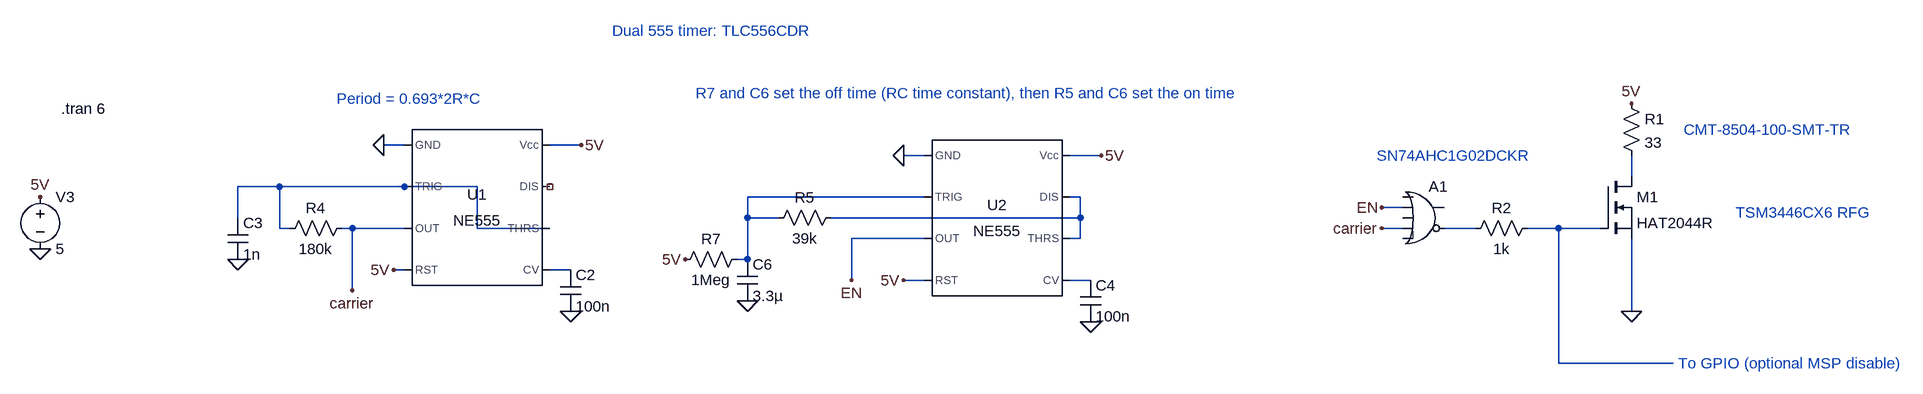
[diagram p0: schematic buzzer circuit.asc]
buzzer circuit.asc, the LTspice schematic file:
Version 4
SHEET 1 3336 748
WIRE 1008 368 976 368
WIRE 1280 368 1232 368
WIRE 1808 384 1776 384
WIRE 2080 384 2032 384
WIRE 2896 416 2896 384
WIRE 816 432 752 432
WIRE 1008 432 816 432
WIRE 1120 432 1008 432
WIRE 1808 448 1536 448
WIRE 2048 448 2032 448
WIRE 2544 464 2512 464
WIRE 752 480 752 432
WIRE 1536 480 1536 448
WIRE 1584 480 1536 480
WIRE 2048 480 2048 448
WIRE 2048 480 1664 480
WIRE 816 496 816 432
WIRE 832 496 816 496
WIRE 928 496 912 496
WIRE 1008 496 928 496
WIRE 1120 496 1120 432
WIRE 1232 496 1120 496
WIRE 2544 496 2512 496
WIRE 2656 496 2608 496
WIRE 2784 496 2736 496
WIRE 2848 496 2784 496
WIRE 1808 512 1696 512
WIRE 2048 512 2048 480
WIRE 2048 512 2032 512
WIRE 1536 544 1536 480
WIRE 1536 544 1520 544
WIRE 1008 560 992 560
WIRE 1264 560 1232 560
WIRE 1696 576 1696 512
WIRE 1808 576 1776 576
WIRE 2064 576 2032 576
WIRE 928 592 928 496
WIRE 2896 624 2896 512
WIRE 2784 704 2784 496
WIRE 2960 704 2784 704
FLAG 976 368 0
FLAG 448 528 0
FLAG 448 448 5V
FLAG 992 560 5V
FLAG 1264 624 0
FLAG 752 544 0
FLAG 1776 384 0
FLAG 2080 384 5V
FLAG 1776 576 5V
FLAG 2064 640 0
FLAG 1536 608 0
FLAG 1440 544 5V
FLAG 1696 576 EN
FLAG 928 592 carrier
FLAG 2512 464 EN
FLAG 2512 496 carrier
FLAG 2896 624 0
FLAG 2896 304 5V
FLAG 1280 368 5V
SYMBOL Misc\\NE555 1120 464 R0
SYMATTR InstName U1
SYMBOL voltage 448 432 R0
WINDOW 123 0 0 Left 0
WINDOW 39 0 0 Left 0
SYMATTR InstName V3
SYMATTR Value 5
SYMBOL cap 1248 560 R0
SYMATTR InstName C2
SYMATTR Value 100n
SYMBOL cap 736 480 R0
SYMATTR InstName C3
SYMATTR Value 1n
SYMBOL res 928 480 R90
WINDOW 0 0 56 VBottom 2
WINDOW 3 32 56 VTop 2
SYMATTR InstName R4
SYMATTR Value 180k
SYMBOL Misc\\NE555 1920 480 R0
SYMATTR InstName U2
SYMBOL cap 2048 576 R0
SYMATTR InstName C4
SYMATTR Value 100n
SYMBOL res 1536 528 R90
WINDOW 0 0 56 VBottom 2
WINDOW 3 32 56 VTop 2
SYMATTR InstName R7
SYMATTR Value 1Meg
SYMBOL cap 1520 544 R0
SYMATTR InstName C6
SYMATTR Value 3.3µ
SYMBOL res 1680 464 R90
WINDOW 0 0 56 VBottom 2
WINDOW 3 32 56 VTop 2
SYMATTR InstName R5
SYMATTR Value 39k
SYMBOL Digital\\or 2576 416 R0
SYMATTR InstName A1
SYMATTR SpiceLine Vhigh=5
SYMBOL nmos 2848 416 R0
SYMATTR InstName M1
SYMATTR Value HAT2044R
SYMBOL res 2880 288 R0
SYMATTR InstName R1
SYMATTR Value 33
SYMBOL res 2752 480 R90
WINDOW 0 0 56 VBottom 2
WINDOW 3 32 56 VTop 2
SYMATTR InstName R2
SYMATTR Value 1k
TEXT 480 312 Left 2 !.tran 6
TEXT 904 296 Left 2 ;Period = 0.693*2R*C
TEXT 1456 288 Left 2 ;R7 and C6 set the off time (RC time constant), then R5 and C6 set the on time
TEXT 2504 384 Left 2 ;SN74AHC1G02DCKR
TEXT 1328 192 Left 2 ;Dual 555 timer: TLC556CDR
TEXT 2976 344 Left 2 ;CMT-8504-100-SMT-TR
TEXT 3056 472 Left 2 ;TSM3446CX6 RFG
TEXT 2968 704 Left 2 ;To GPIO (optional MSP disable)

The netlist it stands for:
* buzzer circuit.asc
XU1 0 N002 carrier 5V N007 N002 NC_01 5V NE555  ; pins GND TRIG OUT RST CV THRS DIS Vcc
V3 5V 0 5
C2 N007 0 100n
C3 N002 0 1n
R4 carrier N002 180k
XU2 0 N003 EN 5V N008 N004 N004 5V NE555  ; pins GND TRIG OUT RST CV THRS DIS Vcc
C4 N008 0 100n
R7 N003 5V 1Meg
C6 N003 0 3.3µ
R5 N004 N003 39k
A1 0 EN 0 carrier 0 N005 0 0 OR Vhigh=5
M1 N001 N006 0 0 HAT2044R
R1 5V N001 33
R2 N006 N005 1k
.model NMOS NMOS
.model PMOS PMOS
.lib standard.mos
.tran 6
* Period = 0.693*2R*C
* R7 and C6 set the off time (RC time constant), then R5 and C6 set the on time
* SN74AHC1G02DCKR
* Dual 555 timer: TLC556CDR
* CMT-8504-100-SMT-TR
* TSM3446CX6 RFG
* To GPIO (optional MSP disable)
.lib NE555.sub
.backanno
.end